# Altium schematic sheet limiter.SchDoc
size A; SheetNumber: 3; SheetTotal: 6
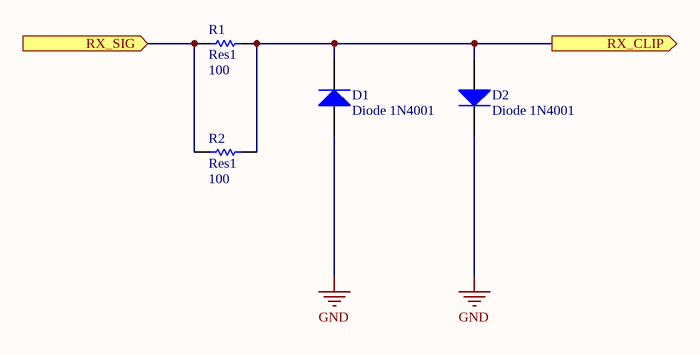
[diagram p0: limiter.SchDoc]

## Parts
D1  Diode 1N4001  [DO-41]
D2  Diode 1N4001  [DO-41]
R1  Res1  value 100  [AXIAL-0.1-RES]
R2  Res1  value 100  [AXIAL-0.1-RES]

## Ports
RX_CLIP (out), RX_SIG (in)

## Nets
GND: D1.1(A) D2.2(K)
RX_CLIP: D1.2(K) D2.1(A) R1.2 R2.2 ; port RX_CLIP
RX_SIG: R1.1 R2.1 ; port RX_SIG

## Library data of the parts
D1 D2 = Diode 1N4001: 1 Amp General Purpose Rectifier; Published: 8-Jun-2000; LatestRevisionDate: 17-Jul-2002; LatestRevisionNote: Re-released for DXP Platform.; DatasheetVersion: 1998; PackageVersion: Aug-1999; PackageReference: DO-41; Publisher: Altium Limited; PackageDescription: Diode, Axial; Body 5.2 x 2.7 mm (LxDia. max), Lead Dia. 0.86 mm (max); Code_JEDEC: DO-204-AL; ComponentLink1Description: Manufacturer Link; ComponentLink1URL: http://www.fairchildsemi.com/; ComponentLink2Description: Datasheet; ComponentLink2URL: http://www.fairchildsemi.com/ds/1N%2F1N4001.pdf
R1 R2 = RES 100 OHM 5% 1/4W AXIAL: Resistor; Manufacturer Part Number: CFR-25JB-52-100R; Designator: R?; Power Rating: 1/4W; Tolerance: 0.05; Published: 8-Jun-2000; LatestRevisionDate: 17-Jul-2002; LatestRevisionNote: Re-released for DXP Platform.; Publisher: Altium Limited